# Altium schematic sheet SENSOR.SchDoc
size A4; SheetNumber: 4; SheetTotal: 4
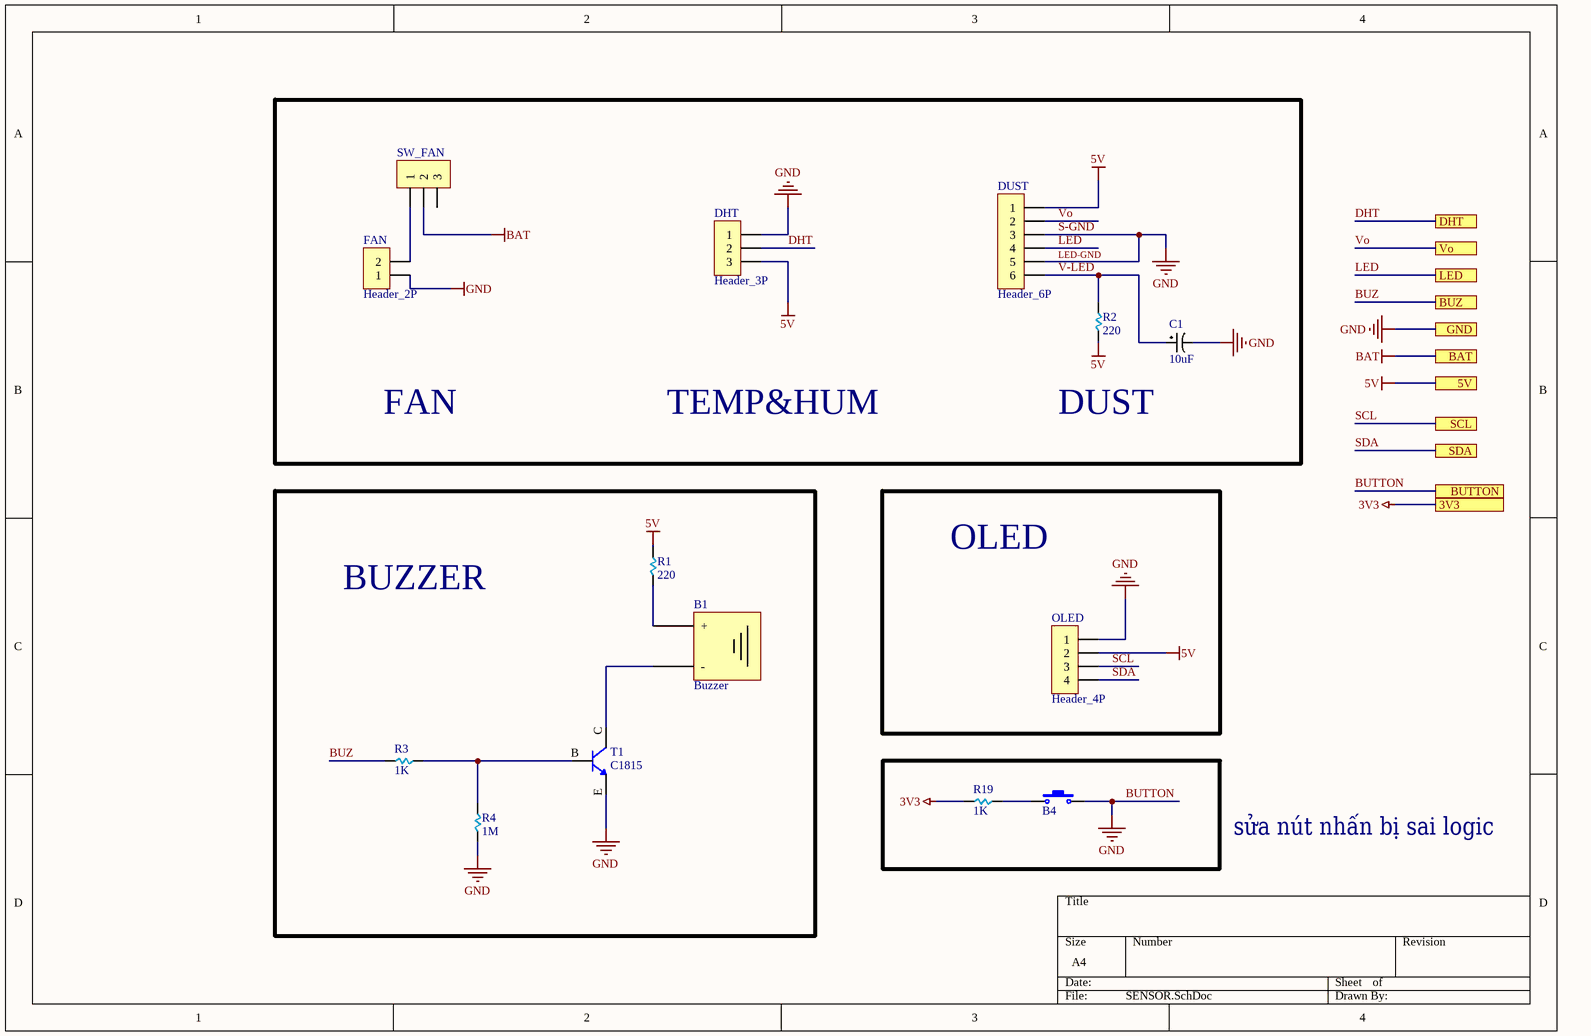
[diagram p0: SENSOR.SchDoc]

## Parts
B1  Buzzer  [Buzzer]
B4  BUTTON  [BUTTON 3x4x2]  (value not drawn)
C1  10uF  [CAP 5x11]
DHT  Header_3P  [3P_1.5_V]
DUST  Header_6P  [6P_1.5_V]
FAN  Header_2P  [2P_1.5_V]
OLED  Header_4P  [4P_1.5_V]
R1  220  [RES 0603]
R2  220  [RES 0603]
R3  1K  [RES 0603]
R4  1M  [RES 0603]
R19  1K  [RES 0603]
SW_FAN  SWITCH  [Switch SK12D07]  (value not drawn)
T1  C1815  [C1815]

## Blocks framed on the sheet
BUZZER: B1 R1 R3 R4 T1
OLED: OLED

## Ports
3V3, 5V, BAT, BUTTON, BUZ, DHT, GND, LED, SCL, SDA, Vo

## Nets
3V3: R19.2 ; port 3V3
5V: DHT.3 DUST.1 OLED.2 R1.1 R2.2 ; port 5V
BAT: SW_FAN.2 ; port BAT
BUTTON: B4.2 C1.2 DHT.1 DUST.3 DUST.5 FAN.1 OLED.1 R4.2 T1.E ; port GND, port BUTTON  [also labelled GND, LED-GND, S-GND]
BUZ: R3.1 ; port BUZ
DHT: DHT.2 ; port DHT
LED: DUST.4 ; port LED
SCL: OLED.3 ; port SCL
SDA: OLED.4 ; port SDA
V-LED: C1.1 DUST.6 R2.1
Vo: DUST.2 ; port Vo
NetB1_+: B1.+ R1.2
NetB1_-: B1.- T1.C
NetB4_1: B4.1 R19.1
NetFAN_2: FAN.2 SW_FAN.1
NetR3_2: R3.2 R4.1 T1.B

Not connected (* = marked no-connect by the designer): SW_FAN 3

## Notes on the sheet
- FAN
- TEMP&HUM
- DUST
- sửa nút nhấn bị sai logic

## Library data of the parts
C1 = Cap_P: Value: 100uF
R1-R4 R19 = RES
  R1 R2: Value: 220
  R3 R19: Value: 1K
  R4: Value: 1M